# Altium schematic sheet 05. LCD.SchDoc
size A4
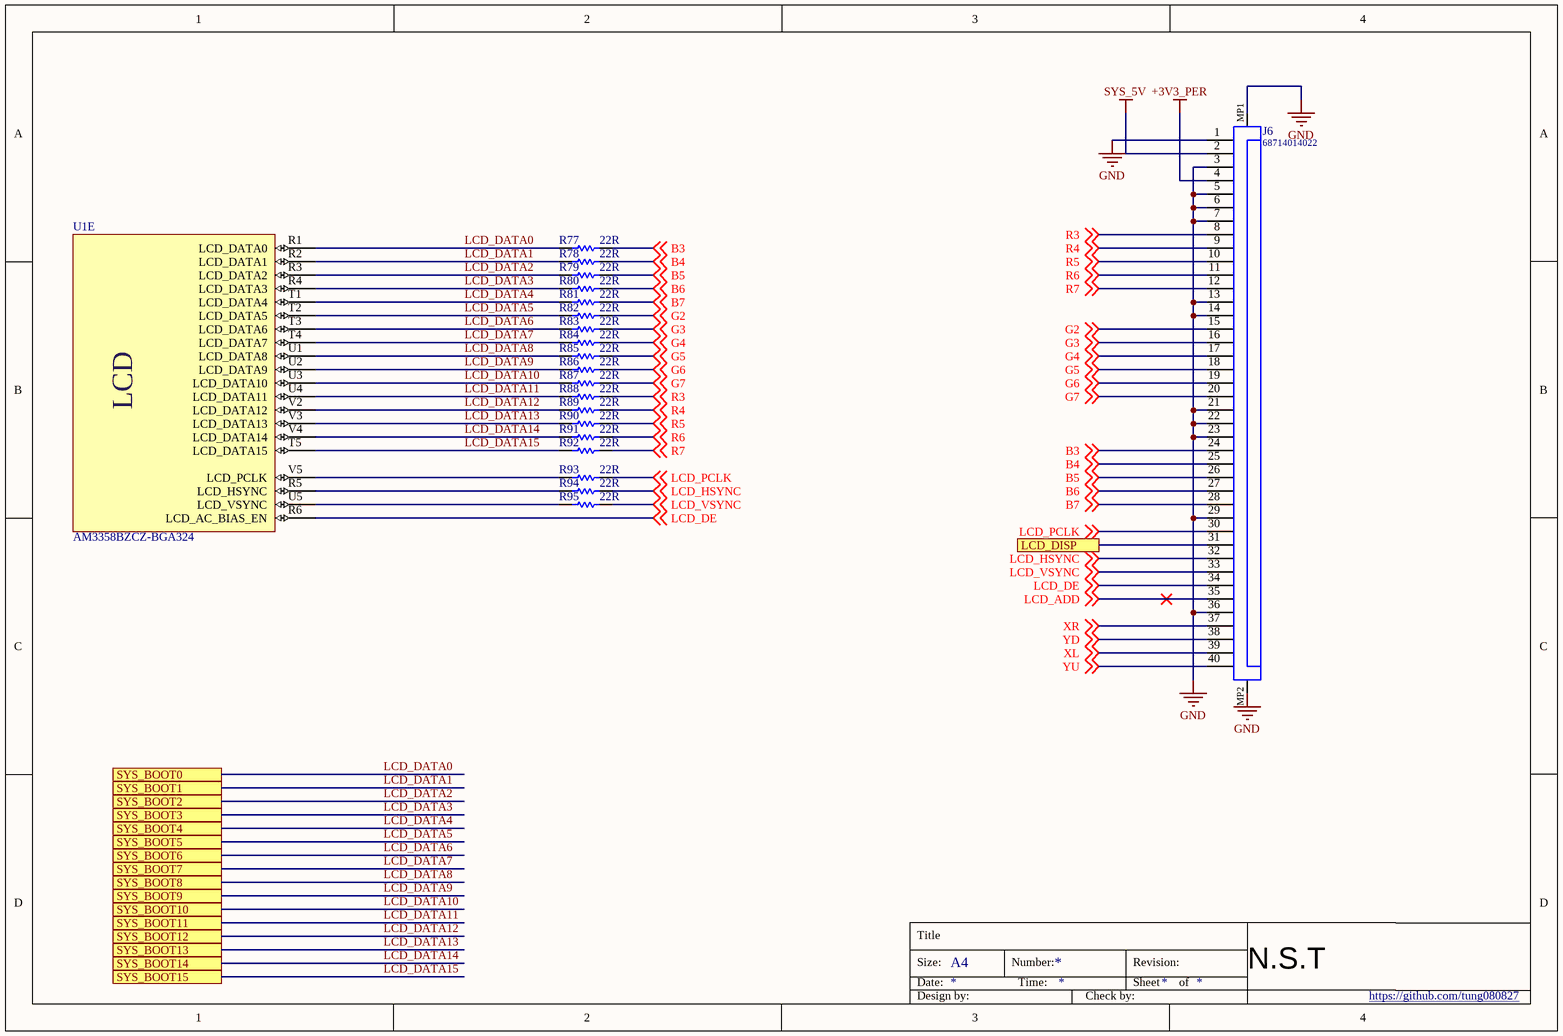
[diagram p0: 05. LCD.SchDoc]

## Parts
J6  68714014022  [68714014022]
R77  22R  [RESC1005X40X25LL05T05]
R78  22R  [RESC1005X40X25LL05T05]
R79  22R  [RESC1005X40X25LL05T05]
R80  22R  [RESC1005X40X25LL05T05]
R81  22R  [RESC1005X40X25LL05T05]
R82  22R  [RESC1005X40X25LL05T05]
R83  22R  [RESC1005X40X25LL05T05]
R84  22R  [RESC1005X40X25LL05T05]
R85  22R  [RESC1005X40X25LL05T05]
R86  22R  [RESC1005X40X25LL05T05]
R87  22R  [RESC1005X40X25LL05T05]
R88  22R  [RESC1005X40X25LL05T05]
R89  22R  [RESC1005X40X25LL05T05]
R90  22R  [RESC1005X40X25LL05T05]
R91  22R  [RESC1005X40X25LL05T05]
R92  22R  [RESC1005X40X25LL05T05]
R93  22R  [RESC1005X40X25LL05T05]
R94  22R  [RESC1005X40X25LL05T05]
R95  22R  [RESC1005X40X25LL05T05]
U1  AM3358BZCZ-BGA324  [TI-ZCZ324]  (part E of 11)

## Ports
LCD_DISP, SYS_BOOT0, SYS_BOOT1, SYS_BOOT2, SYS_BOOT3, SYS_BOOT4, SYS_BOOT5, SYS_BOOT6, SYS_BOOT7, SYS_BOOT8, SYS_BOOT9, SYS_BOOT10, SYS_BOOT11, SYS_BOOT12, SYS_BOOT13, SYS_BOOT14, SYS_BOOT15

## Nets
+3V3_PER: J6.4
GND: J6.1 J6.3 J6.5 J6.6 J6.7 J6.13 J6.14 J6.21 J6.22 J6.23 J6.29 J6.36 J6.MP1 J6.MP2
SYS_5V: J6.2
B3: J6.24 R77.2 ; off-sheet B3
B4: J6.25 R78.2 ; off-sheet B4
B5: J6.26 R79.2 ; off-sheet B5
B6: J6.27 R80.2 ; off-sheet B6
B7: J6.28 R81.2 ; off-sheet B7
G2: J6.15 R82.2 ; off-sheet G2
G3: J6.16 R83.2 ; off-sheet G3
G4: J6.17 R84.2 ; off-sheet G4
G5: J6.18 R85.2 ; off-sheet G5
G6: J6.19 R86.2 ; off-sheet G6
G7: J6.20 R87.2 ; off-sheet G7
LCD_ADD: J6.35 ; off-sheet LCD_ADD
LCD_DATA0: R77.1 U1.R1(LCD_DATA0) ; port SYS_BOOT0
LCD_DATA1: R78.1 U1.R2(LCD_DATA1) ; port SYS_BOOT1
LCD_DATA2: R79.1 U1.R3(LCD_DATA2) ; port SYS_BOOT2
LCD_DATA3: R80.1 U1.R4(LCD_DATA3) ; port SYS_BOOT3
LCD_DATA4: R81.1 U1.T1(LCD_DATA4) ; port SYS_BOOT4
LCD_DATA5: R82.1 U1.T2(LCD_DATA5) ; port SYS_BOOT5
LCD_DATA6: R83.1 U1.T3(LCD_DATA6) ; port SYS_BOOT6
LCD_DATA7: R84.1 U1.T4(LCD_DATA7) ; port SYS_BOOT7
LCD_DATA8: R85.1 U1.U1(LCD_DATA8) ; port SYS_BOOT8
LCD_DATA9: R86.1 U1.U2(LCD_DATA9) ; port SYS_BOOT9
LCD_DATA10: R87.1 U1.U3(LCD_DATA10) ; port SYS_BOOT10
LCD_DATA11: R88.1 U1.U4(LCD_DATA11) ; port SYS_BOOT11
LCD_DATA12: R89.1 U1.V2(LCD_DATA12) ; port SYS_BOOT12
LCD_DATA13: R90.1 U1.V3(LCD_DATA13) ; port SYS_BOOT13
LCD_DATA14: R91.1 U1.V4(LCD_DATA14) ; port SYS_BOOT14
LCD_DATA15: R92.1 U1.T5(LCD_DATA15) ; port SYS_BOOT15
LCD_DE: J6.34 U1.R6(LCD_AC_BIAS_EN) ; off-sheet LCD_DE
LCD_DISP: J6.31 ; port LCD_DISP
LCD_HSYNC: J6.32 R94.2 ; off-sheet LCD_HSYNC
LCD_PCLK: J6.30 R93.2 ; off-sheet LCD_PCLK
LCD_VSYNC: J6.33 R95.2 ; off-sheet LCD_VSYNC
R3: J6.8 R88.2 ; off-sheet R3
R4: J6.9 R89.2 ; off-sheet R4
R5: J6.10 R90.2 ; off-sheet R5
R6: J6.11 R91.2 ; off-sheet R6
R7: J6.12 R92.2 ; off-sheet R7
XL: J6.39 ; off-sheet XL
XR: J6.37 ; off-sheet XR
YD: J6.38 ; off-sheet YD
YU: J6.40 ; off-sheet YU
NetR93_1: R93.1 U1.V5(LCD_PCLK)
NetR94_1: R94.1 U1.R5(LCD_HSYNC)
NetR95_1: R95.1 U1.U5(LCD_VSYNC)

## Notes on the sheet
- Title
- Size:
- Date:
- A4
- Number:
- Time:
- Revision:
- Sheet
- of
- N.S.T
- Design by:
- Check by:
- https://github.com/tung080827
- (in symbol AM3358BZCZ100, part E) LCD

## Library data of the parts
J6 = CMP-1502-01568-1: SMT ZIF Connectors WR-FPC, Horizontal, Top Contact, pitch 0.5 mm, 40 pins; Manufacturer: Wurth Elektronik; Pitch: 0.5mm; Working Voltage: 50VAC; Withstanding Voltage: 250VAC; Pin Number: 40; Contact Resistance: 20mOhm; Rated Current: 0.5A; Package Reference: 68714014022; Operating Temperature: -25to85degC; Packaging: TapeandReel; Datasheet URL: https://katalog.we-online.de/em/datasheet/68714014022.pdf; Mounting Technology: SMT; Part Number: 68714014022; Contact Design: TopContact; Manufacturer URL: http://www.we-online.de; Publisher: WurthElektronik; Orientation: Horizontal
R77-R95 = CMP-1665-00027-3: Chip Resistor, 22 Ohm, +/- 1%, 0.1 W, -55 to 155 degC, 0402 (1005 Metric), RoHS, Tape and Reel; PartNumber: ERJ-2RKF22R0X; Case\/Package: 0402; Resistance: 22 Ohm; Power Rating: 100 mW; Voltage Rating: 50 V; ComponentLink2Description: Datasheet; Packaging: Tape and Reel; Weight: 2.8E-05oz; Pins: 2; Case Code (Imperial): 0402; Width: 0.5 mm; ComponentLink2URL: http://industrial.panasonic.com/cdbs/www-data/pdf/RDA0000/AOA0000C86.pdf; Height: 0.35 mm; PackageReference: 0402; REACH SVHC: Yes; Min Operating Temperature: -55 degC; Length: 1 mm; DatasheetVersion: 04/2015; RoHSCompliant: true; Package Quantity: 10000; Case Code (Metric): 1005; PackageDescription: 2-Pin Surface Mount Device, Body 1 x 0.5 mm; ComponentLink1URL: http://www.panasonic.com/; Mount: Surface Mount; Mounting Technology: Surface Mount; Tolerance: 1%; Max Operating Temperature: 155 degC; ComponentLink1Description: Manufacturer URL
U1 = AM3358BZCZ100: Sitara ARM Cortex-A8 32-Bit RISC Microprocessor, 1 GHz, SGX530 3D Graphics Engine, Programmable Real-Time Unit and Industrial Communication Subsystem (PRU-ICSS), 0 to 90 degC, 324-pin NFBGA (ZCZ), Green (RoHS & no Sb/Br); Supplier 1: Digi-Key